# EAGLE design espboard (EAGLE 7.6.0)
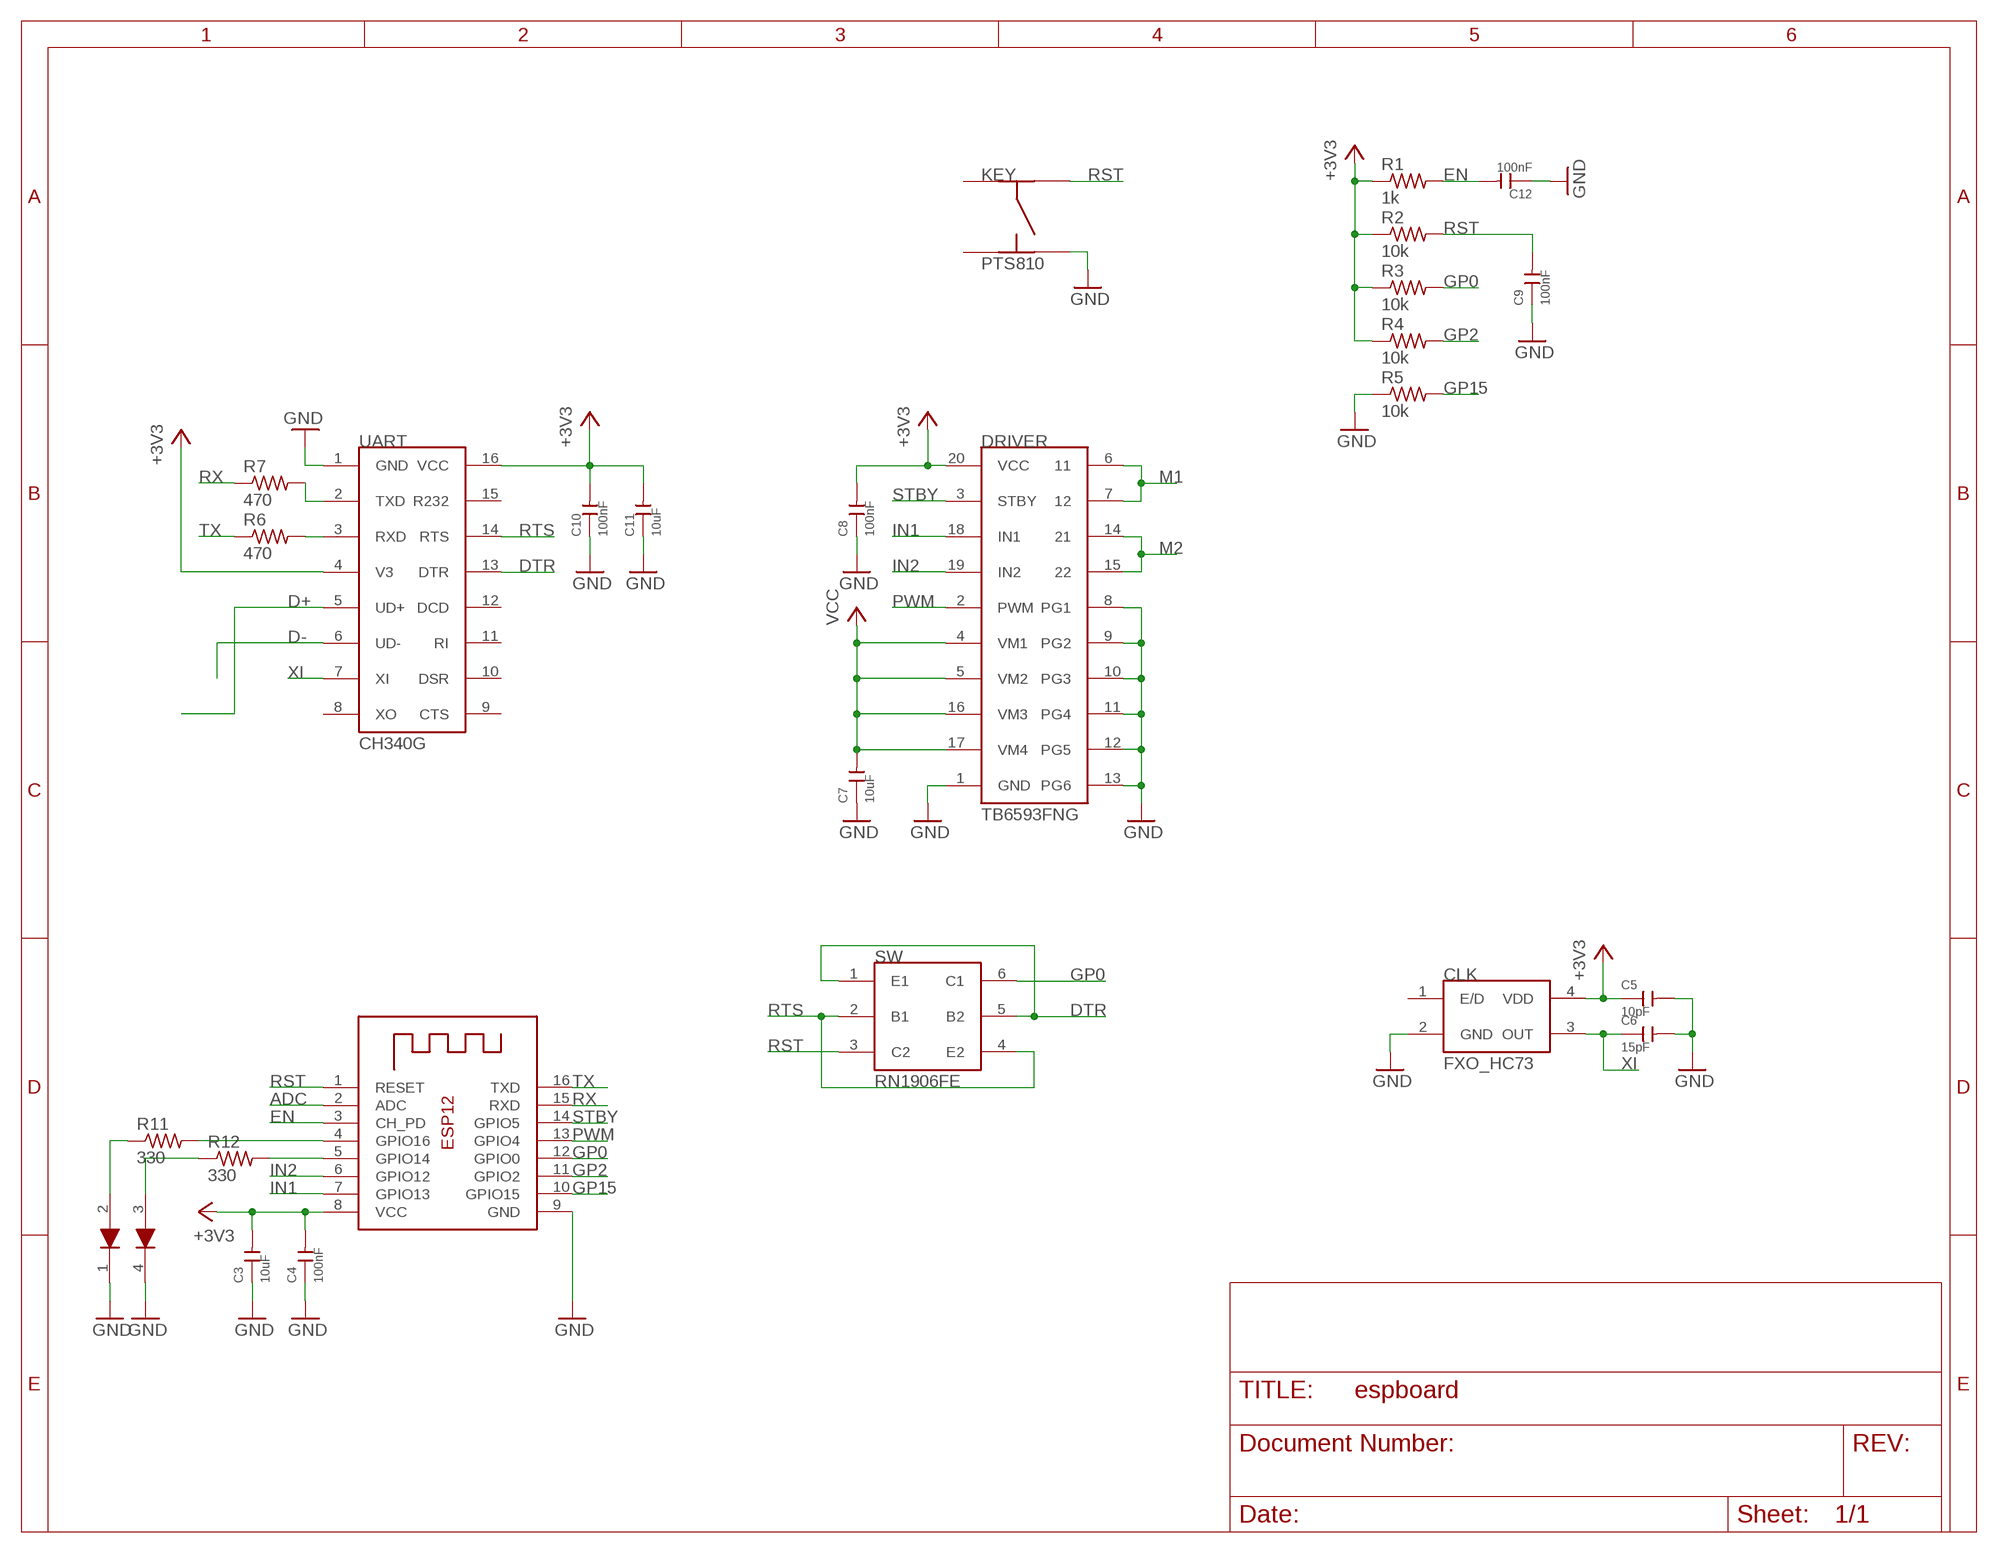
[diagram p0: schematic, sheet 1]

## Parts
C3  10uF  CERAMIC-0.5PF-50V-0.1PF-NPO(0603)  [C0603]
C4  100nF  CERAMIC-0.5PF-50V-0.1PF-NPO(0603)  [C0603]
C5  10pF  CERAMIC-0.5PF-50V-0.1PF-NPO(0603)  [C0603]
C6  15pF  CERAMIC-0.5PF-50V-0.1PF-NPO(0603)  [C0603]
C7  10uF  CERAMIC-0.5PF-50V-0.1PF-NPO(0603)  [C0603]
C8  100nF  CERAMIC-0.5PF-50V-0.1PF-NPO(0603)  [C0603]
C9  100nF  CERAMIC-1PF-50V-0.25PF-NPO(0603)  [C0603]
C10  100nF  CERAMIC-0.5PF-50V-0.1PF-NPO(0603)  [C0603]
C11  10uF  CERAMIC-0.5PF-50V-0.1PF-NPO(0603)  [C0603]
C12  100nF  CERAMIC-1PF-50V-0.25PF-NPO(0603)  [C0603]
CLK  FXO_HC73  [4-SMD]
DRIVER  TB6593FNG  [SSOP-20]
ESP12  ESP-12  [ESP-12]
KEY  PTS810  BUTTON  [BUTTON]
R1  1k  R-US_R0603  [R0603]
R2  10k  R-US_R0603  [R0603]
R3  10k  R-US_R0603  [R0603]
R4  10k  R-US_R0603  [R0603]
R5  10k  R-US_R0603  [R0603]
R6  470  R-US_R0603  [R0603]
R7  470  R-US_R0603  [R0603]
R11  330  R-US_R0603  [R0603]
R12  330  R-US_R0603  [R0603]
SW  RN1906FE  [SOT-563]
U$2  BI_LED  [BI_LED]
UART  CH340G  [20-16]

## Nets
+3V3: C3.2 C4.2 C5.1 C8.2 C10.2 C11.2 CLK.4(VDD) DRIVER.20(VCC) ESP12.8(VCC) R1.1 R2.1 R3.1 R4.1 UART.4(V3) UART.16(VCC)
ADC: ESP12.2(ADC)
D+: UART.5(UD+)
D-: UART.6(UD-)
DTR: SW.1(E1) SW.5(B2) UART.13(DTR)
EN: C12.2 ESP12.3(CH_PD) R1.2
GND: C3.1 C4.1 C5.2 C6.2 C7.1 C8.1 C9.1 C10.1 C11.1 C12.1 CLK.2(GND) DRIVER.1(GND) DRIVER.8(PG1) DRIVER.9(PG2) DRIVER.10(PG3) DRIVER.11(PG4) DRIVER.12(PG5) DRIVER.13(PG6) ESP12.9(GND) KEY.4 R5.1 U$2.1 U$2.4 UART.1(GND)
GP0: ESP12.12(GPIO0) R3.2 SW.6(C1)
GP2: ESP12.11(GPIO2) R4.2
GP15: ESP12.10(GPIO15) R5.2
IN1: DRIVER.18(IN1) ESP12.7(GPIO13)
IN2: DRIVER.19(IN2) ESP12.6(GPIO12)
M1: DRIVER.6 DRIVER.7
M2: DRIVER.14 DRIVER.15
N$1: R7.2 UART.2(TXD)
N$7: R6.2 UART.3(RXD)
N$8: ESP12.5(GPIO14) R12.2
N$9: ESP12.4(GPIO16) R11.2
N$11: R11.1 U$2.2
N$12: R12.1 U$2.3
PWM: DRIVER.2(PWM) ESP12.13(GPIO4)
RST: C9.2 ESP12.1(RESET) KEY.2 R2.2 SW.3(C2)
RTS: SW.2(B1) SW.4(E2) UART.14(RTS)
RX: ESP12.15(RXD) R7.1
STBY: DRIVER.3(STBY) ESP12.14(GPIO5)
TX: ESP12.16(TXD) R6.1
VCC: C7.2 DRIVER.4(VM1) DRIVER.5(VM2) DRIVER.16(VM3) DRIVER.17(VM4)
XI: C6.1 CLK.3(OUT) UART.7(XI)
Unconnected: CLK.1(E/D) KEY.1 KEY.3 UART.8(XO) UART.9(CTS) UART.10(DSR) UART.11(RI) UART.12(DCD) UART.15(R232)

## Library data of the parts
C3-C8 C10 C11 = Seeed-OPL-Capacitor:CERAMIC-0.5PF-50V-0.1PF-NPO(0603): 302010115; VALUE: 0.5PF 50V
C9 C12 = Seeed-OPL-Capacitor:CERAMIC-1PF-50V-0.25PF-NPO(0603): 302010096; VALUE: 1PF 50V 00.25PF
CLK = CUSTOM:FXO_HC73
DRIVER = CUSTOM:TB6593FNG
ESP12 = adafruit:ESP-12
KEY = CUSTOM:BUTTON
R1-R7 R11 R12 = resistor:R-US_: RESISTOR, American symbol
SW = CUSTOM:RN1906FE
U$2 = CUSTOM:BI_LED
UART = CUSTOM:CH340G

## Board
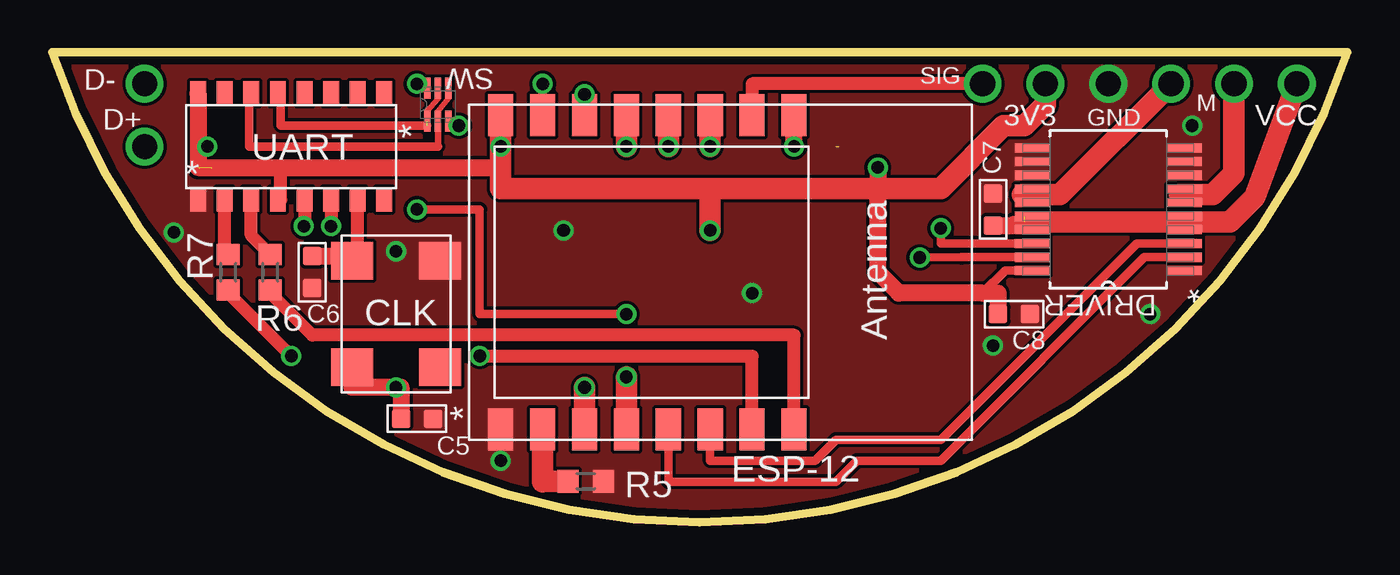
[diagram p1: board, top side]
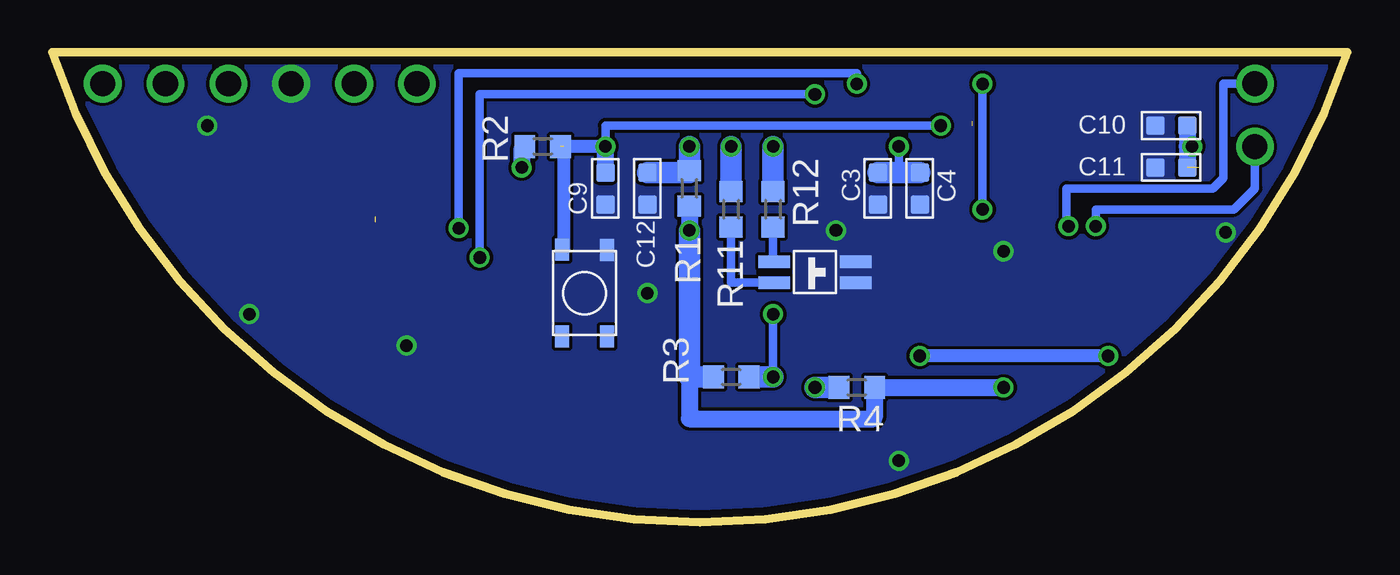
[diagram p2: board, bottom side, seen from below]

Size 61.8 x 22.45 mm. Coordinates in mm from the lower left corner, seen from the top.
Outline: 0,22.45 61.8,22.45 arc-144 0,22.45
Copper layers (1*16): Top 0.0356mm / dielectric 1.5011mm / Bottom 0.0356mm
Design rules "LaenPCBOrder": minimum track width 6mil, minimum drill 13mil, track to track 6mil, track to pad 6mil, pad to pad 6mil, via to via 6mil, smd to smd 6mil, copper to edge 15mil, drill to drill 6mil, minimum pad ring 7mil, minimum via ring 7mil, stop-mask expansion 3mil, vias tented up to drill 0mil, thermal gap 10mil

### Footprints (pad centres in the part's own frame; a part is rotated, then mirrored left to right if it is on the bottom)
C0603 = smd 0.889 x 0.889: 1 0,0.762; 2 0,-0.762
4-SMD = smd 1.8 x 2: 1 -2.54,-2.1; 2 2.54,-2.1; 3 2.54,2.1; 4 -2.54,2.1
SSOP-20 = smd 1.651 x 0.432: 1 -3.632,2.921; 2 -3.632,2.286; 3 -3.632,1.626; 4 -3.632,0.965; 5 -3.632,0.33; 6 -3.632,-0.33; 7 -3.632,-0.965; 8 -3.632,-1.626; 9 -3.632,-2.286; 10 -3.632,-2.921; 11 3.632,-2.921; 12 3.632,-2.286; 13 3.632,-1.626; 14 3.632,-0.965; 15 3.632,-0.33; 16 3.632,0.33; 17 3.632,0.965; 18 3.632,1.626; 19 3.632,2.286; 20 3.632,2.921
ESP-12 = smd 2 x 1.2: 1 -7.5,4.5; 2 -7.5,2.5; 3 -7.5,0.5; 4 -7.5,-1.5; 5 -7.5,-3.5; 6 -7.5,-5.5; 7 -7.5,-7.5; 8 -7.5,-9.5; 9 7.5,-9.5; 10 7.5,-7.5; 11 7.5,-5.5; 12 7.5,-3.5; 13 7.5,-1.5; 14 7.5,0.5; 15 7.5,2.5; 16 7.5,4.5
BUTTON = smd 1.05 x 0.65: 1 -2.075,1.075; 2 2.075,1.075; 3 -2.075,-1.075; 4 2.07,-1.075
R0603 = smd 1 x 1.1: 1 -0.85,0; 2 0.85,0
SOT-563 = smd 1.016 x 0.305: 1 -0.787,0.508; 2 -0.787,0; 3 -0.787,-0.508; 4 0.787,-0.508; 5 0.787,0; 6 0.787,0.508
BI_LED = smd 0.6 x 1.5: 1 -0.5,-1.95; 2 -0.5,1.95; 3 0.5,1.95; 4 0.5,-1.95
20-16 = smd 0.762 x 1.143: 1 -4.445,-2.54; 2 -3.175,-2.54; 3 -1.905,-2.54; 4 -0.635,-2.54; 5 0.635,-2.54; 6 1.905,-2.54; 7 3.175,-2.54; 8 4.445,-2.54; 9 4.445,2.54; 10 3.175,2.54; 11 1.905,2.54; 12 0.635,2.54; 13 -0.635,2.54; 14 -1.905,2.54; 15 -3.175,2.54; 16 -4.445,2.54

### Placement (x,y rotation side)
C3  22.4,15.95 180 bottom
C4  20.4,15.95 180 bottom
C5  17.4,4.95 90 top
C6  12.4,11.95 0 top
C7  44.9,14.95 0 top
C8  45.9,9.95 270 top
C9  35.4,15.95 180 bottom
C10  8.4,18.95 90 bottom
C11  8.4,16.95 90 bottom
C12  33.4,15.95 180 bottom
CLK  16.4,9.95 90 top
DRIVER  50.4,14.95 180 top
ESP12  30.9,11.95 270 top
KEY  36.4,10.95 90 bottom
R1  31.4,15.95 90 bottom
R2  38.4,17.95 0 bottom
R3  29.4,6.95 0 bottom
R4  23.4,6.45 180 bottom
R5  25.45,1.97 180 top
R6  10.4,11.95 90 top
R7  8.4,11.95 90 top
R11  29.4,14.95 90 bottom
R12  27.4,14.95 90 bottom
SW  18.4,19.95 90 top
U$2  25.4,11.95 90 bottom
UART  11.4,17.95 0 top

### Tracks (layer width: path | path; a pad name or v marks a point on that pad's centre or on a via)
+3V3  (via drill 0.6, 1.2)  (1 unrouted)
  Top 0.406: DRIVER.20 45.48,12.03 44.4,10.95
  Top 0.61: UART.4 10.9,15.41 10.9,16.95 | 21.4,16.95 v21.4,17.95
  Top 0.813: C8.2 45.14,10.95 44.4,10.95 40.4,10.95 39.4,11.95 39.4,15.95 v39.4,16.95 | 14.3,6.95 CLK.4 14.3,6.45 v16.4,6.45 16.64,6.45 C5.1 | 21.4,16.95 10.9,16.95 6.96,16.95 UART.16
  Top 1.016: ESP12.8 v21.4,17.95 21.4,15.95 31.4,15.95 | v47.4,20.95 47.4,19.95 46.4,18.95 45.4,18.95 42.4,15.95 39.4,15.95 31.4,15.95 | v31.4,13.95 31.4,15.95
  Bottom 0.406: v21.4,17.95 21.4,16.71
  Bottom 0.813: R1.1 v31.4,13.95 | 22.4,6.45 v16.4,6.45 | C11.2 C10.2 7.64,17.95 v7.4,17.95 | 31.4,6.95 31.4,4.95 22.6,4.95 22.55,5.1 R4.1 | R2.1 39.4,17.8 v39.4,16.95
  Bottom 1.016: C3.2 21.4,16.71 C4.2 | v31.4,13.95 31.4,6.95 R3.1 | R4.1 22.4,6.45
ADC  (via drill 1.2)
  Top 0.61: v44.4,20.95 33.4,20.95 ESP12.2
D+  (via drill 0.6, 1.2)
  Top 0.61: UART.5 12.04,14.15 v12,14.15
  Bottom 0.406: v12,14.15 12,14.95 5.4,14.95 4.4,15.95 v4.4,17.95
D-  (via drill 0.6, 1.2)
  Top 0.61: UART.6 v13.3,14.15
  Bottom 0.406: 13.4,14.25 13.4,15.95 6.4,15.95 5.9,16.45 5.9,20.95 v4.4,20.95
  Bottom 0.61: v13.3,14.15 13.4,14.25
DTR  (1 unrouted)
  Top 0.254: SW.5 18.4,20.25 17.89,19.64 17.89,18.95
  Top 0.406: 17.89,18.95 10.9,18.95 10.9,20.49 UART.13
EN  (via drill 0.6)
  Top 1.016: v31.4,17.95 ESP12.3
  Bottom 0.406: 31.4,16.71 R1.2
  Bottom 1.016: C12.2 31.4,16.71 | R1.2 v31.4,17.95
GND  (via drill 0.6, 1.2)
  other vias: 50.4,20.95 54.4,18.95 44.9,8.45 21.4,2.95 16.4,12.95 5.8,13.85 52.4,9.95 24.4,13.95 33.4,10.95
  pour Top (no thermals): 0,22.45 61.8,22.45 arc-144
  pour Bottom (no thermals): 0,22.45 61.8,22.45 arc-144
GP0  (via drill 0.6)
  Top 0.406: v27.4,9.95 20.4,9.95 20.4,14.95 v17.4,14.95 | v17.4,20.95 17.4,20.74 SW.6
  Top 1.016: v27.4,6.95 ESP12.12
  Bottom 0.406: v27.4,6.95 v27.4,9.95 | v17.4,14.95 v17.4,20.95
  Bottom 1.016: R3.2 v27.4,6.95
GP2  (via drill 0.6)
  Top 1.016: ESP12.11 v25.4,6.45
  Bottom 1.016: v25.4,6.45 R4.2
GP15
  Top 1.016: ESP12.10 23.4,1.95 23.42,1.97 R5.2
IN1  (via drill 0.6)
  Top 0.406: DRIVER.18 42.4,13.32 v42.4,14.05 | v23.4,20.95 ESP12.7
  Bottom 0.406: v42.4,14.05 42.4,21.45 23.4,21.45 v23.4,20.95
IN2  (via drill 0.6)
  Top 0.406: DRIVER.19 43.4,12.66 v41.4,12.65 | v25.4,20.45 ESP12.6
  Bottom 0.406: v25.4,20.45 41.4,20.45 v41.4,12.65
M1  (via drill 1.2)
  Top 0.305: DRIVER.6 DRIVER.7 54.03,15.88 53.8,15.65
  Top 1.016: 53.8,15.65 55.4,15.65 56.4,16.65 v56.4,20.95
M2  (via drill 1.2)
  Top 0.305: DRIVER.15 DRIVER.14 46.56,15.92 46.3,15.65
  Top 1.016: v53.4,20.95 48.1,15.65 46.3,15.65
N$1
  Top 0.61: R7.2 8.22,12.98 UART.2
N$7
  Top 0.61: R6.2 9.5,13.71 UART.3
N$8  (via drill 0.6)
  Top 1.016: v27.4,17.95 ESP12.5
  Bottom 1.016: R12.2 v27.4,17.95
N$9  (via drill 0.6)
  Top 1.016: v29.4,17.95 ESP12.4
  Bottom 1.016: R11.2 v29.4,17.95
N$11
  Bottom 0.406: U$2.2 29.4,11.45 R11.1
N$12
  Bottom 0.406: U$2.3 27.4,12.48 R12.1
PWM
  Top 0.406: DRIVER.2 52.11,12.66 42.4,2.95 38.4,2.95 37.4,1.95 29.4,1.95 ESP12.13
RST  (via drill 0.6)  (1 unrouted)
  Top 0.254: SW.3 19.12,18.95 v19.4,18.95
  Top 0.406: 19.4,19.16 v19.4,18.95
  Top 0.813: v35.4,17.95 ESP12.1
  Bottom 0.406: v19.4,18.95 35.4,18.95 v35.4,17.95
  Bottom 0.61: v35.4,17.95 37.4,17.95 37.4,13.03 KEY.2
  Bottom 0.813: C9.2 v35.4,17.95
RTS
  Top 0.254: SW.4 18.91,20.26 18.4,19.65 SW.2
  Top 0.305: 18.4,17.95 SW.2
  Top 0.406: 18.4,17.95 9.4,17.95 9.4,20.49 UART.14
RX  (via drill 0.6)
  Top 0.61: ESP12.15 33.4,7.95 v20.4,7.95 | v11.4,7.95 8.4,10.95 R7.1
  Bottom 0.61: v11.4,7.95 v20.4,7.95
STBY
  Top 0.406: DRIVER.3 51.77,13.32 42.4,3.95 37.4,3.95 36.4,2.95 31.4,2.95 ESP12.14
TX
  Top 0.61: ESP12.16 35.4,8.95 12.4,8.95 10.4,10.95 R6.1
VCC  (via drill 1.2)  (1 unrouted)
  Top 0.305: DRIVER.5 DRIVER.4 54.03,14.35 56.2,14.35 | DRIVER.17 DRIVER.16 46.4,14.62 46.4,13.95
  Top 0.406: 45.9,14.25 46.77,14.25 DRIVER.16
  Top 0.813: C7.2 45.9,14.19 45.9,14.25
  Top 1.016: v59.4,20.95 57.4,15.55 56.2,14.35 46.4,14.35
XI
  Top 0.61: CLK.3 14.58,12.49 UART.7
  Top 0.813: C6.1 14.3,12.71 CLK.3

### Text on the board
tPlace: D- | SIG | M | D+ | 3V3 | GND | VCC | ESP-12